# Altium project HANC_Analog.PrjPcb
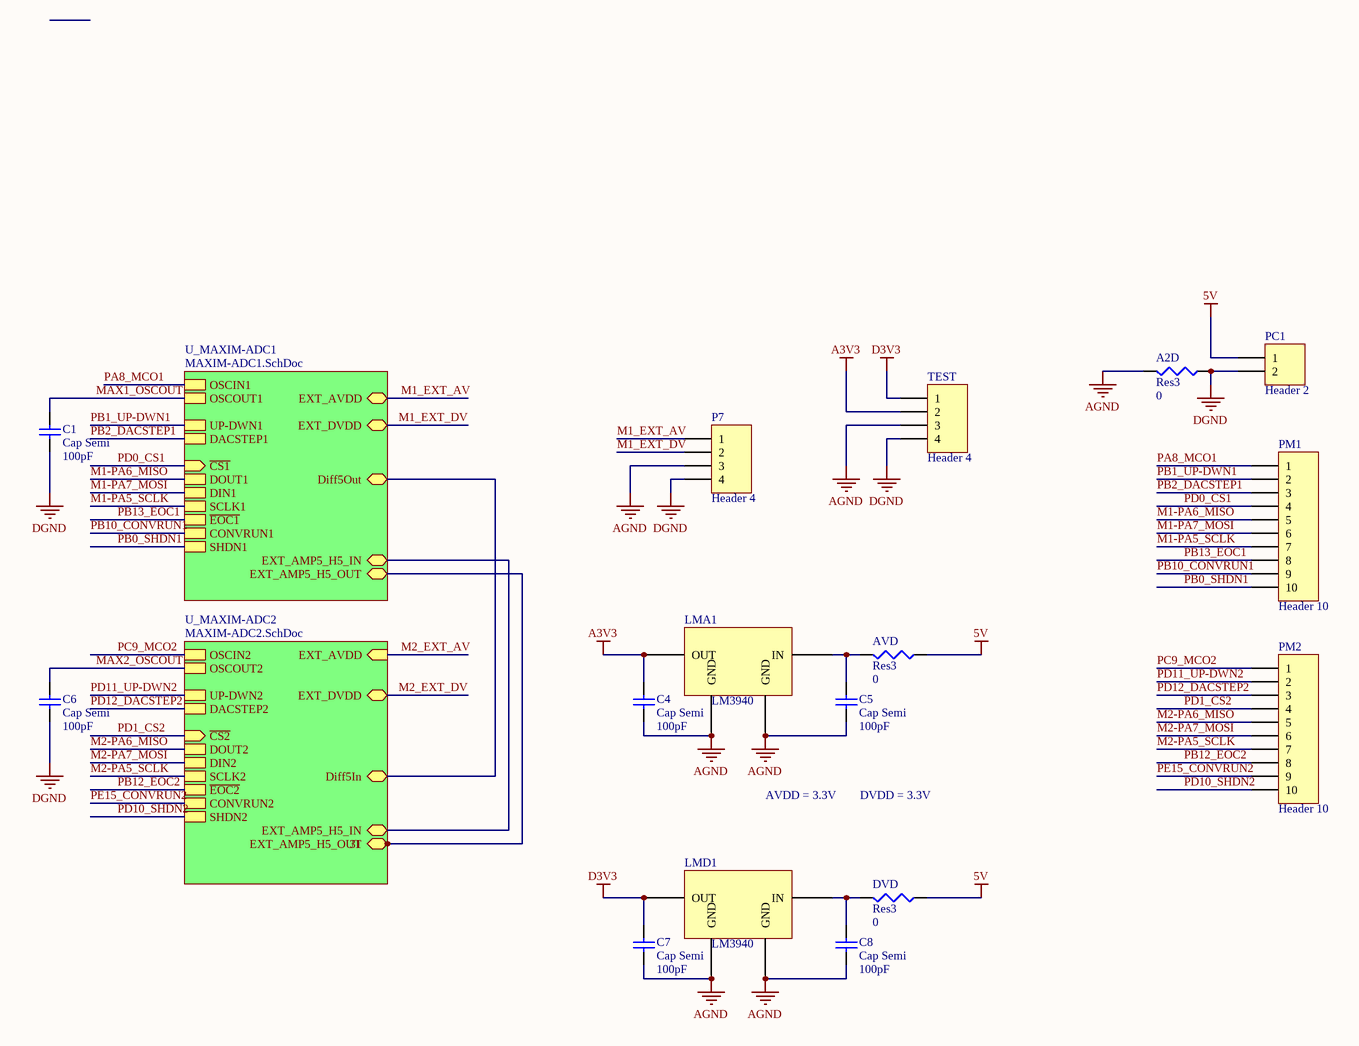
[diagram p0: HANC_Analog_TS.SchDoc]
5 sheets, 187 parts. Net scope: hierarchical (ports join the sheet entries above them; power ports are global).
Board file: HANC_ANALOG.PcbDoc
Sheets:
  HANC_Analog_TS.SchDoc
    U_MAXIM-ADC2 = MAXIM-ADC2.SchDoc
      HAMP2 = HydrophoneGroup2FilterAndAmpCircuit.SchDoc
    U_MAXIM-ADC1 = MAXIM-ADC1.SchDoc
      HAMP1 = HydrophoneGroup1FilterAndAmpCircuit.SchDoc

## Sheet HANC_Analog_TS.SchDoc
size B

### Parts
A2D  Res3  value 0  [J1-0603]
AVD  Res3  value 0  [J1-0603]
C1  Cap Semi  value 100pF  [1608[0603]]
C4  Cap Semi  value 100pF  [1608[0603]]
C5  Cap Semi  value 100pF  [1608[0603]]
C6  Cap Semi  value 100pF  [1608[0603]]
C7  Cap Semi  value 100pF  [1608[0603]]
C8  Cap Semi  value 100pF  [1608[0603]]
DVD  Res3  value 0  [J1-0603]
LMA1  LM3940  [SOT223_N]
LMD1  LM3940  [SOT223_N]
P7  Header 4  [HDR1X4]
PC1  Header 2  [HDR1X2]
PM1  Header 10  [HDR1X10]
PM2  Header 10  [HDR1X10]
TEST  Header 4  [HDR1X4]

### Sub-sheets
U_MAXIM-ADC1 = MAXIM-ADC1.SchDoc: OSCIN1, OSCOUT1, UP-DWN1, DACSTEP1, ~{CS1} (in), DOUT1, DIN1, SCLK1, ~{EOC1}, CONVRUN1, SHDN1, EXT_AVDD, EXT_DVDD, Diff5Out, EXT_AMP5_H5_IN, EXT_AMP5_H5_OUT
U_MAXIM-ADC2 = MAXIM-ADC2.SchDoc: OSCIN2, OSCOUT2, UP-DWN2, DACSTEP2, ~{CS2} (in), DOUT2, DIN2, SCLK2, ~{EOC2}, CONVRUN2, SHDN2, EXT_AVDD (in), EXT_DVDD, Diff5In, 31, EXT_AMP5_H5_OUT, EXT_AMP5_H5_IN

### Nets
5V: AVD.1 DVD.1 PC1.1
A3V3: C4.2 LMA1.3(OUT) TEST.2
AGND: A2D.2 C4.1 C5.1 C7.1 C8.1 LMA1.2(GND) LMA1.4(GND) LMD1.2(GND) LMD1.4(GND) P7.3 TEST.3
D3V3: C7.2 LMD1.3(OUT) TEST.1
DGND: A2D.1 C1.1 C6.1 P7.4 PC1.2 TEST.4
M1-PA5_SCLK: PM1.7 ; sheet U_MAXIM-ADC1/SCLK1
M1-PA6_MISO: PM1.5 ; sheet U_MAXIM-ADC1/DOUT1
M1-PA7_MOSI: PM1.6 ; sheet U_MAXIM-ADC1/DIN1
M1_EXT_AV: P7.1 ; sheet U_MAXIM-ADC1/EXT_AVDD
M1_EXT_DV: P7.2 ; sheet U_MAXIM-ADC1/EXT_DVDD
M2-PA5_SCLK: PM2.7 ; sheet U_MAXIM-ADC2/SCLK2
M2-PA6_MISO: PM2.5 ; sheet U_MAXIM-ADC2/DOUT2
M2-PA7_MOSI: PM2.6 ; sheet U_MAXIM-ADC2/DIN2
M2_EXT_AV: sheet U_MAXIM-ADC2/EXT_AVDD
M2_EXT_DV: sheet U_MAXIM-ADC2/EXT_DVDD
MAX1_OSCOUT: C1.2 ; sheet U_MAXIM-ADC1/OSCOUT1
MAX2_OSCOUT: C6.2 ; sheet U_MAXIM-ADC2/OSCOUT2
PA8_MCO1: PM1.1 ; sheet U_MAXIM-ADC1/OSCIN1
PB0_SHDN1: PM1.10 ; sheet U_MAXIM-ADC1/SHDN1
PB1_UP-DWN1: PM1.2 ; sheet U_MAXIM-ADC1/UP-DWN1
PB2_DACSTEP1: PM1.3 ; sheet U_MAXIM-ADC1/DACSTEP1
PB10_CONVRUN1: PM1.9 ; sheet U_MAXIM-ADC1/CONVRUN1
PB12_EOC2: PM2.8 ; sheet U_MAXIM-ADC2/~{EOC2}
PB13_EOC1: PM1.8 ; sheet U_MAXIM-ADC1/~{EOC1}
PC9_MCO2: PM2.1 ; sheet U_MAXIM-ADC2/OSCIN2
PD0_CS1: PM1.4 ; sheet U_MAXIM-ADC1/~{CS1}
PD1_CS2: PM2.4 ; sheet U_MAXIM-ADC2/~{CS2}
PD10_SHDN2: PM2.10 ; sheet U_MAXIM-ADC2/SHDN2
PD11_UP-DWN2: PM2.2 ; sheet U_MAXIM-ADC2/UP-DWN2
PD12_DACSTEP2: PM2.3 ; sheet U_MAXIM-ADC2/DACSTEP2
PE15_CONVRUN2: PM2.9 ; sheet U_MAXIM-ADC2/CONVRUN2
NetAVD_2: AVD.2 C5.2 LMA1.1(IN)
NetC8_2: C8.2 DVD.2 LMD1.1(IN)
NetC203_1: sheet U_MAXIM-ADC2/Diff5In, sheet U_MAXIM-ADC1/Diff5Out
NetEFIN_5: sheet U_MAXIM-ADC2/31, sheet U_MAXIM-ADC2/EXT_AMP5_H5_OUT, sheet U_MAXIM-ADC1/EXT_AMP5_H5_OUT
NetHP5O_2: sheet U_MAXIM-ADC2/EXT_AMP5_H5_IN, sheet U_MAXIM-ADC1/EXT_AMP5_H5_IN

### Notes on the sheet
- AVDD = 3.3V
- DVDD = 3.3V

### Library data of the parts
A2D AVD DVD = Res3: Resistor; Published: 8-Jun-2000; LatestRevisionDate: 29-May-2009; LatestRevisionNote: IPC-7351 Footprint Added.; PackageReference: J1-0603; Publisher: Altium Limited; PackageDescription: Chip Resistor
C1 C4-C8 = Cap Semi: Capacitor (Semiconductor SIM Model); Published: 8-Jun-2000; LatestRevisionDate: 29-May-2009; LatestRevisionNote: IPC-7351 Footprint Added.; PackageReference: C1206; Publisher: Altium Limited; PackageDescription: Chip Capacitor
LMA1 LMD1 = Component_1
P7 = Header 4: External power for ADC1; LatestRevisionDate: 17-Jul-2002; LatestRevisionNote: Re-released for DXP Platform.; Publisher: Altium Limited
PC1 = Header 2: Power for analog board; LatestRevisionDate: 17-Jul-2002; LatestRevisionNote: Re-released for DXP Platform.; Publisher: Altium Limited
PM1 = Header 10: GPIO for ADC1; LatestRevisionDate: 17-Jul-2002; LatestRevisionNote: Re-released for DXP Platform.; Publisher: Altium Limited
PM2 = Header 10: GPIO for ADC2; LatestRevisionDate: 17-Jul-2002; LatestRevisionNote: Re-released for DXP Platform.; Publisher: Altium Limited
TEST = Header 4: Header, 4-Pin; LatestRevisionDate: 17-Jul-2002; LatestRevisionNote: Re-released for DXP Platform.; Publisher: Altium Limited

## Sheet MAXIM-ADC2.SchDoc
size B
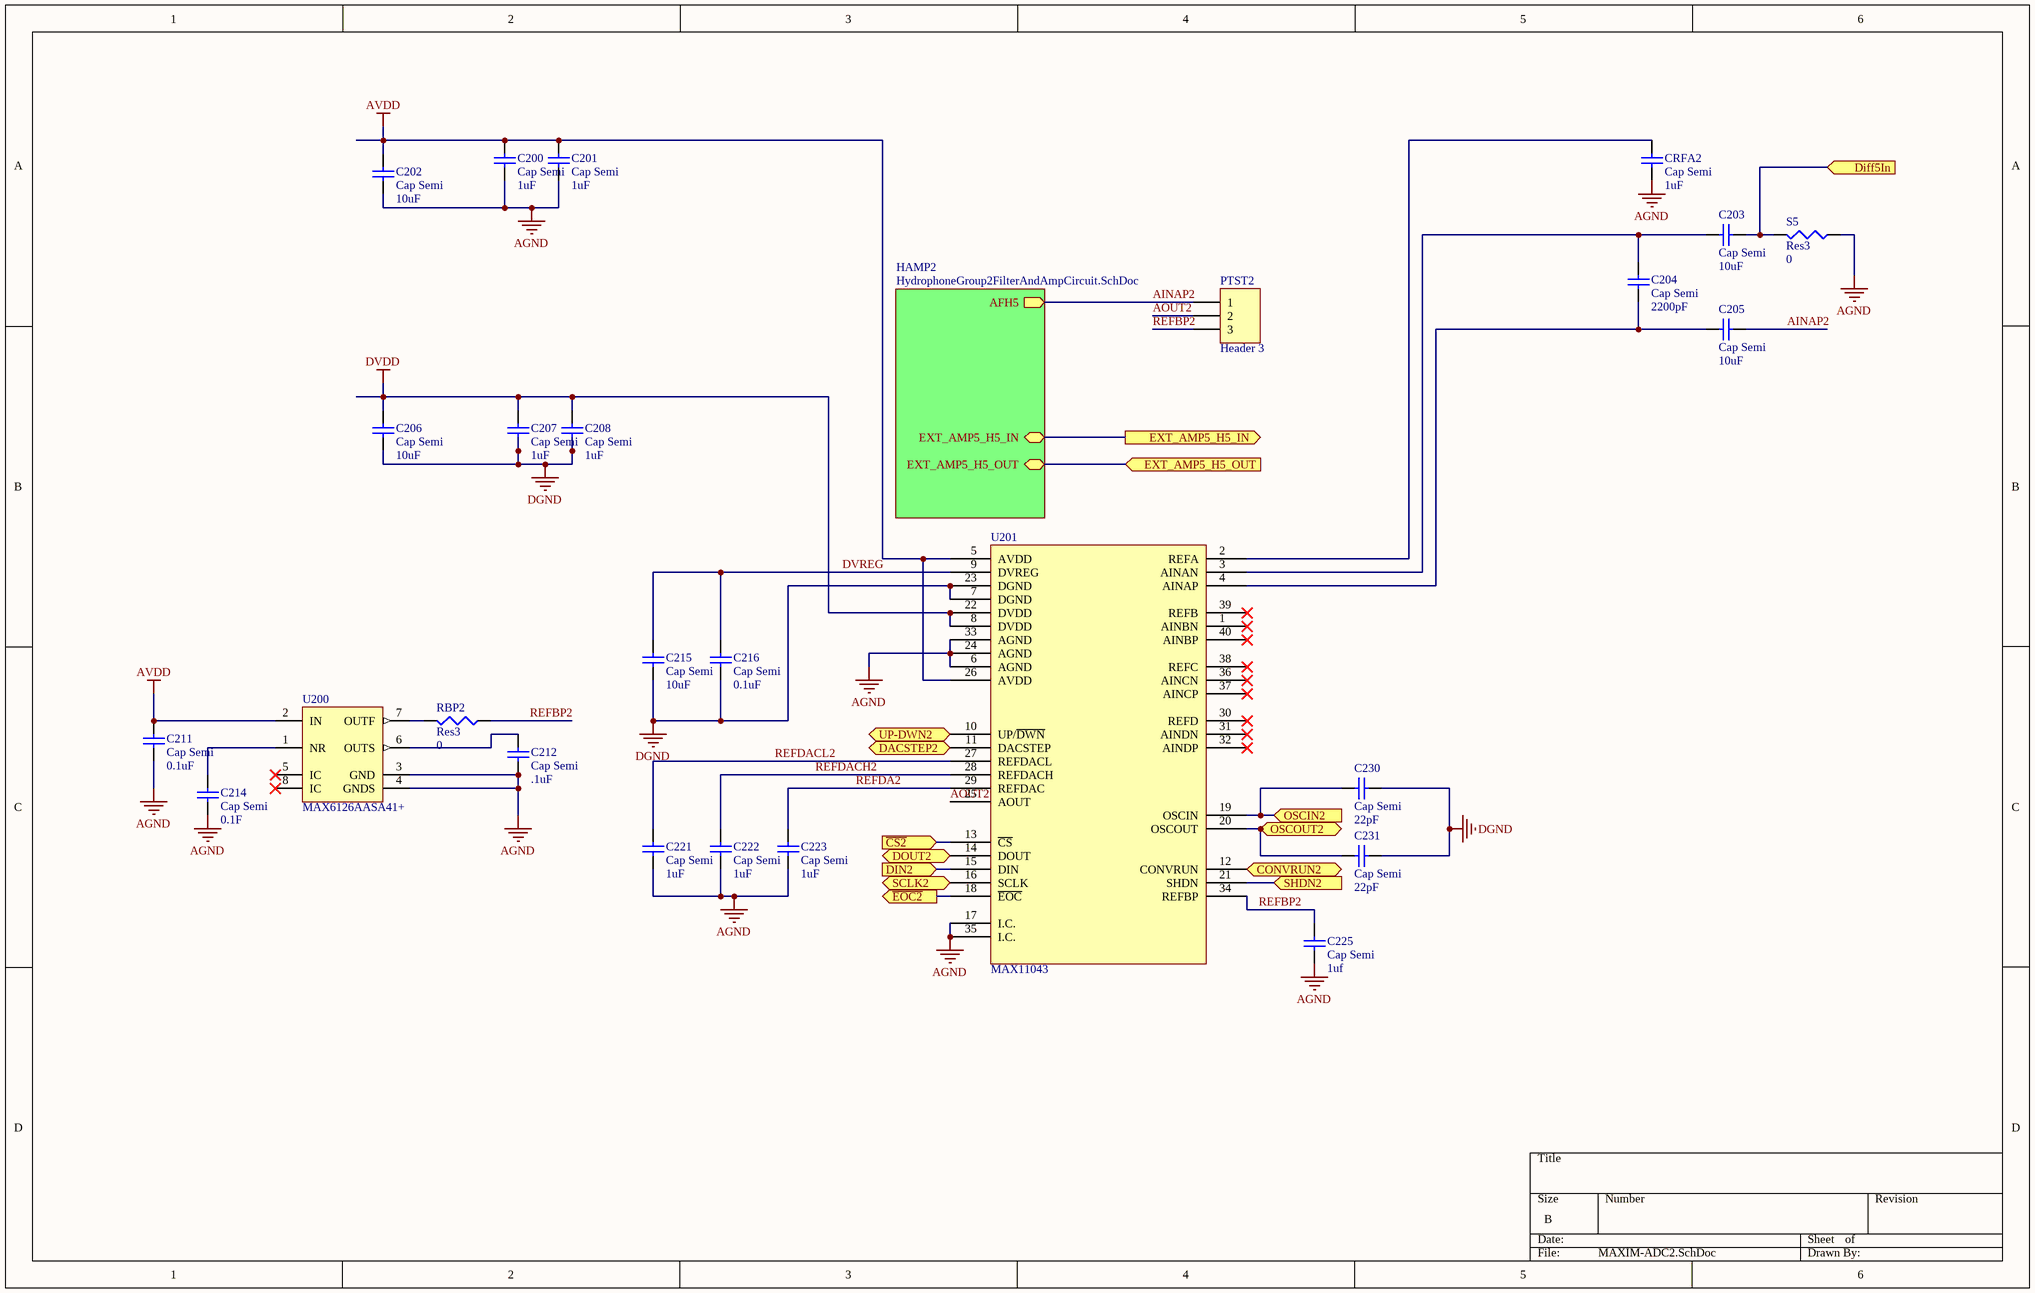
[diagram p1: MAXIM-ADC2.SchDoc]

### Parts
C200  Cap Semi  value 1uF  [1608[0603]]
C201  Cap Semi  value 1uF  [1608[0603]]
C202  Cap Semi  value 10uF  [1608[0603]]
C203  Cap Semi  value 10uF  [1608[0603]]
C204  Cap Semi  value 2200pF  [1608[0603]]
C205  Cap Semi  value 10uF  [1608[0603]]
C206  Cap Semi  value 10uF  [1608[0603]]
C207  Cap Semi  value 1uF  [1608[0603]]
C208  Cap Semi  value 1uF  [1608[0603]]
C211  Cap Semi  value 0.1uF  [1608[0603]]
C212  Cap Semi  value .1uF  [1608[0603]]
C214  Cap Semi  value 0.1F  [1608[0603]]
C215  Cap Semi  value 10uF  [1608[0603]]
C216  Cap Semi  value 0.1uF  [1608[0603]]
C221  Cap Semi  value 1uF  [1608[0603]]
C222  Cap Semi  value 1uF  [1608[0603]]
C223  Cap Semi  value 1uF  [1608[0603]]
C225  Cap Semi  value 1uf  [1608[0603]]
C230  Cap Semi  value 22pF  [1608[0603]]
C231  Cap Semi  value 22pF  [1608[0603]]
CRFA2  Cap Semi  value 1uF  [1608[0603]]
PTST2  Header 3  [HDR1X3]
RBP2  Res3  value 0  [J1-0603]
S5  Res3  value 0  [J1-0603]
U200  MAX6126AASA41+  [MAXM-S8+4_M]
U201  MAX11043  [QFN50P600X600X80_HS-41N]

### Sub-sheets
HAMP2 = HydrophoneGroup2FilterAndAmpCircuit.SchDoc: AFH5 (out), EXT_AMP5_H5_IN, EXT_AMP5_H5_OUT

### Ports
CONVRUN2 (in), DACSTEP2 (in), Diff5In (in), DIN2 (in), DOUT2, EXT_AMP5_H5_IN (out), EXT_AMP5_H5_OUT (in), OSCIN2 (in), OSCOUT2 (out), SCLK2 (in), SHDN2 (in), UP-DWN2 (in), ~{CS2} (in), ~{EOC2} (out)

### Nets
AGND: C200.2 C201.2 C202.2 C211.2 C212.2 C214.2 C221.1 C222.2 C223.1 C225.2 CRFA2.1 S5.1 U200.3(GND) U200.4(GNDS) U201.6(AGND) U201.17(I.C.) U201.24(AGND) U201.33(AGND) U201.35(I.C.)
AVDD: C200.1 C201.1 C202.1 C211.1 U200.2(IN) U201.5(AVDD) U201.26(AVDD)
DGND: C206.2 C207.2 C208.2 C215.2 C216.2 C230.2 C231.2 U201.7(DGND) U201.23(DGND)
DVDD: C206.1 C207.1 C208.1 U201.8(DVDD) U201.22(DVDD)
AINAP2: C205.1 PTST2.1 ; sheet HAMP2/AFH5
AOUT2: PTST2.2 U201.25(AOUT)
DVREG: C215.1 C216.1 U201.9(DVREG)
M2-PA5_SCLK: U201.16(SCLK) ; port SCLK2
M2-PA6_MISO: U201.14(DOUT) ; port DOUT2
M2-PA7_MOSI: U201.15(DIN) ; port DIN2
MAX2_OSCOUT: C231.1 U201.20(OSCOUT) ; port OSCOUT2
PB12_EOC2: U201.18(~{EOC}) ; port ~{EOC2}
PC9_MCO2: C230.1 U201.19(OSCIN) ; port OSCIN2
PD1_CS2: U201.13(~{CS}) ; port ~{CS2}
PD10_SHDN2: U201.21(SHDN) ; port SHDN2
PD11_UP-DWN2: U201.10(UP/~{DWN}) ; port UP-DWN2
PD12_DACSTEP2: U201.11(DACSTEP) ; port DACSTEP2
PE15_CONVRUN2: U201.12(CONVRUN) ; port CONVRUN2
REFBP2: C225.1 PTST2.3 RBP2.1 U201.34(REFBP)
REFDA2: C223.2 U201.29(REFDAC)
REFDACH2: C222.1 U201.28(REFDACH)
REFDACL2: C221.2 U201.27(REFDACL)
NetC203_1: C203.1 S5.2 ; port Diff5In
NetC203_2: C203.2 C204.2 U201.3(AINAN)
NetC204_1: C204.1 C205.2 U201.4(AINAP)
NetC212_1: C212.1 U200.6(OUTS)
NetC214_1: C214.1 U200.1(NR)
NetCRFA2_2: CRFA2.2 U201.2(REFA)
NetEFIN_5: port EXT_AMP5_H5_OUT, sheet HAMP2/EXT_AMP5_H5_OUT
NetHP5O_2: port EXT_AMP5_H5_IN, sheet HAMP2/EXT_AMP5_H5_IN
NetRBP2_2: RBP2.2 U200.7(OUTF)

Not connected (* = marked no-connect by the designer): U200 5(IC)* 8(IC)*; U201 1(AINBN)* 30(REFD)* 31(AINDN)* 32(AINDP)* 36(AINCN)* 37(AINCP)* 38(REFC)* 39(REFB)* 40(AINBP)*

### Library data of the parts
C200-C208 C211 C212 C214-C216 C221-C223 C225 C230 C231 CRFA2 = Cap Semi: Capacitor (Semiconductor SIM Model); Published: 8-Jun-2000; LatestRevisionDate: 29-May-2009; LatestRevisionNote: IPC-7351 Footprint Added.; PackageReference: C1206; Publisher: Altium Limited; PackageDescription: Chip Capacitor
PTST2 = Header 3: ADC2 Signal Test Header; LatestRevisionDate: 17-Jul-2002; LatestRevisionNote: Re-released for DXP Platform.; Publisher: Altium Limited
RBP2 S5 = Res3: Resistor; Published: 8-Jun-2000; LatestRevisionDate: 29-May-2009; LatestRevisionNote: IPC-7351 Footprint Added.; PackageReference: J1-0603; Publisher: Altium Limited; PackageDescription: Chip Resistor
U200 = CMP-0977-00016-1: Ultra-High-Precision, Ultra-Low-Noise, Series Voltage Reference, 4.096 V, -40 to 125 degC, 8-Pin SOIC (S8+4), RoHS, Tube; Manufacturer: Maxim; Output Voltage Accuracy: 0.02% Max.; Line Regulation: 60 uV/V Max.; VOUT: 4.096 V; Dropout Voltage@10 mA: 0.1 V Typ.; VIN: 4.3 to 12.6 V; Operating Temperature: -40 to 125 degC; ComponentLink3URL: http://pdfserv.maximintegrated.com/package_dwgs/21-0041.PDF; PartNumber: MAX6126AASA41+; RoHS: TRUE; ComponentLink3Description: Package Specification; ComponentLink1URL: http://www.maximintegrated.com/; Mounting Technology: Surface Mount; Packing: Tube; DatasheetVersion: Rev. 6; ComponentLink1Description: Manufacturer URL; ComponentLink2URL: http://datasheets.maximintegrated.com/en/ds/MAX6126.pdf; PackageDescription: 8-Pin Small Outline Integrated Circuit Package, Body 4.9 x 3.9 mm, Pitch 1.27 mm; ComponentLink2Description: Datasheet; PackageVersion: Rev. E

## Sheet HydrophoneGroup2FilterAndAmpCircuit.SchDoc
size C
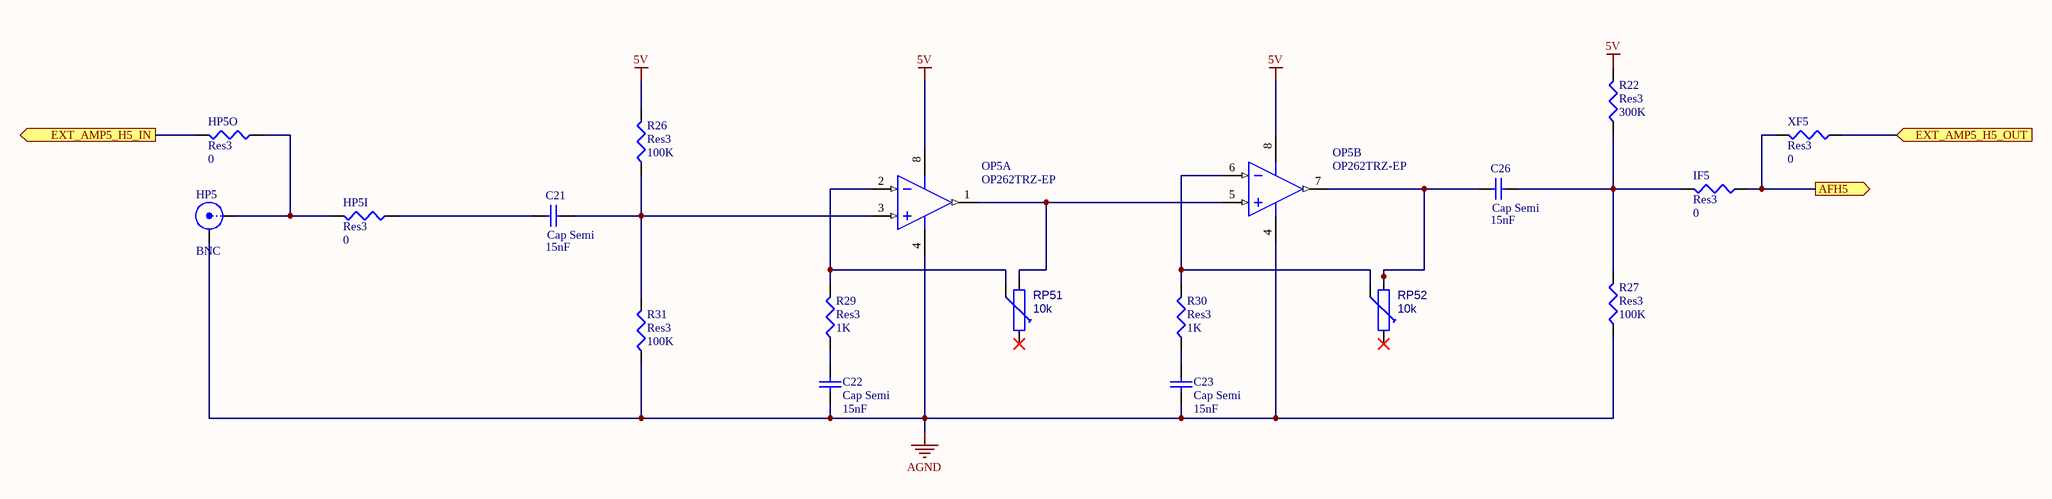
[diagram p2: HydrophoneGroup2FilterAndAmpCircuit.SchDoc]

### Parts
C21  Cap Semi  value 15nF  [C0805]
C22  Cap Semi  value 15nF  [C0805]
C23  Cap Semi  value 15nF  [C0805]
C26  Cap Semi  value 15nF  [C0805]
HP5  BNC  [BNC_RA CON]
HP5I  Res3  value 0  [J1-0603]
HP5O  Res3  value 0  [J1-0603]
IF5  Res3  value 0  [J1-0603]
OP5  OP262TRZ-EP  [ADI-R-8_N]  (parts A,B of 2)
R22  Res3  value 300K  [J1-0603]
R26  Res3  value 100K  [J1-0603]
R27  Res3  value 100K  [J1-0603]
R29  Res3  value 1K  [J1-0603]
R30  Res3  value 1K  [J1-0603]
R31  Res3  value 100K  [J1-0603]
RP51  10k  [Trim_Bourns3296]
RP52  10k  [Trim_Bourns3296]
XF5  Res3  value 0  [J1-0603]

### Ports
AFH5 (out), EXT_AMP5_H5_IN (out), EXT_AMP5_H5_OUT (in)

### Nets
5V: OP5.8(+V) R22.2 R26.2
AGND: C22.1 C23.1 HP5.2(Y) OP5.4(-V) R27.1 R31.1
AINAP2: IF5.1 XF5.2 ; port AFH5
NetC21_1: C21.1 HP5I.1
NetC21_2: C21.2 OP5.3(+IN_A) R26.1 R31.2
NetC22_2: C22.2 R29.1
NetC23_2: C23.2 R30.1
NetC26_1: C26.1 OP5.7(OUT_B) RP52.1
NetC26_2: C26.2 IF5.2 R22.1 R27.2
NetEFIN_5: XF5.1 ; port EXT_AMP5_H5_OUT
NetHP5_1: HP5.1(X) HP5I.2 HP5O.1
NetHP5O_2: HP5O.2 ; port EXT_AMP5_H5_IN
NetOP5_1: OP5.1(OUT_A) OP5.5(+IN_B) RP51.1
NetOP5_2: OP5.2(-IN_A) R29.2 RP51.2
NetOP5_6: OP5.6(-IN_B) R30.2 RP52.2

Not connected (* = marked no-connect by the designer): RP51 3*; RP52 3*

### Library data of the parts
C21-C23 C26 = Cap Semi: Capacitor (Semiconductor SIM Model); Published: 8-Jun-2000; LatestRevisionDate: 29-May-2009; LatestRevisionNote: IPC-7351 Footprint Added.; PackageReference: C1206; Publisher: Altium Limited; PackageDescription: Chip Capacitor
HP5 = BNC: BNC Elbow Connector; LatestRevisionDate: 17-Jul-2002; LatestRevisionNote: Re-released for DXP Platform.; Publisher: Altium Limited
HP5I HP5O IF5 R22 R26 R27 R29-R31 XF5 = Res3: Resistor; Published: 8-Jun-2000; LatestRevisionDate: 29-May-2009; LatestRevisionNote: IPC-7351 Footprint Added.; PackageReference: J1-0603; Publisher: Altium Limited; PackageDescription: Chip Resistor
OP5 = OP262TRZ-EP: Double Channel Wide Bandwidth Operational Amplifier, 15 MHz BW, 13 V/us SR, Military, 8-pin SOIC (R-8), Tube; Generic Part Number: OP262; Manufacturer: Analog Devices; Amplifiers Per Package: 2; Input Bias Current: 260nA; Input Offset Voltage: 25uV; Iq/Amp: 775uA; Slew Rate: 13V/us; Small Signal Bandwidth: 15MHz; V Span Max: 12V; V Span Min: 2.7V; DatasheetVersion: Rev. G; PackageVersion: 060506-A; PackageReference: R-8; PackageDescription: 8-Pin Standard Small Outline Package, Body 3.9 x 4.9 mm, Pitch 1.27 mm; Supplier 1: Digi-Key; Supplier Part Number 1: OP262TRZ-EP-ND; Supplier 2: Newark; Supplier Part Number 2: 85R9009; Packing: Tube; Mounting Technology: Surface Mount; Code_JEDEC: MS-012-AA; PartNumber: OP262TRZ-EP; ComponentLink1Description: Manufacturer URL; ComponentLink1URL: http://www.analog.com/en/index.html; ComponentLink2Description: Datasheet; ComponentLink2URL: http://www.analog.com/static/imported-files/data_sheets/OP162_262_462.pdf; ComponentLink3Description: Package Specification; ComponentLink3URL: http://www.analog.com/static/imported-files/packages/PKG_PDF/SOIC_Narrow%20(R)/R_8.pdf
RP51 RP52 = RES_Trim: Resistor Trimmer; Part_Number: RES_Trim_Bourns3296; Part Description: Trimmer, Bourns 3296 0.5W; Mfr Part Number: Bourns 3296Y-1-xxxLF; Validated: False; Value: 10k; Type: RES; Distributor info: RS 3296Y-1-xxxLF (1k=3296Y-1-102LF); Price: 2,03; ComponentLink1Description: Manufacturer; ComponentLink1URL: http://bourns.de/; Creation Date: 05.12.2011; IPC: False

## Sheet MAXIM-ADC1.SchDoc
size B
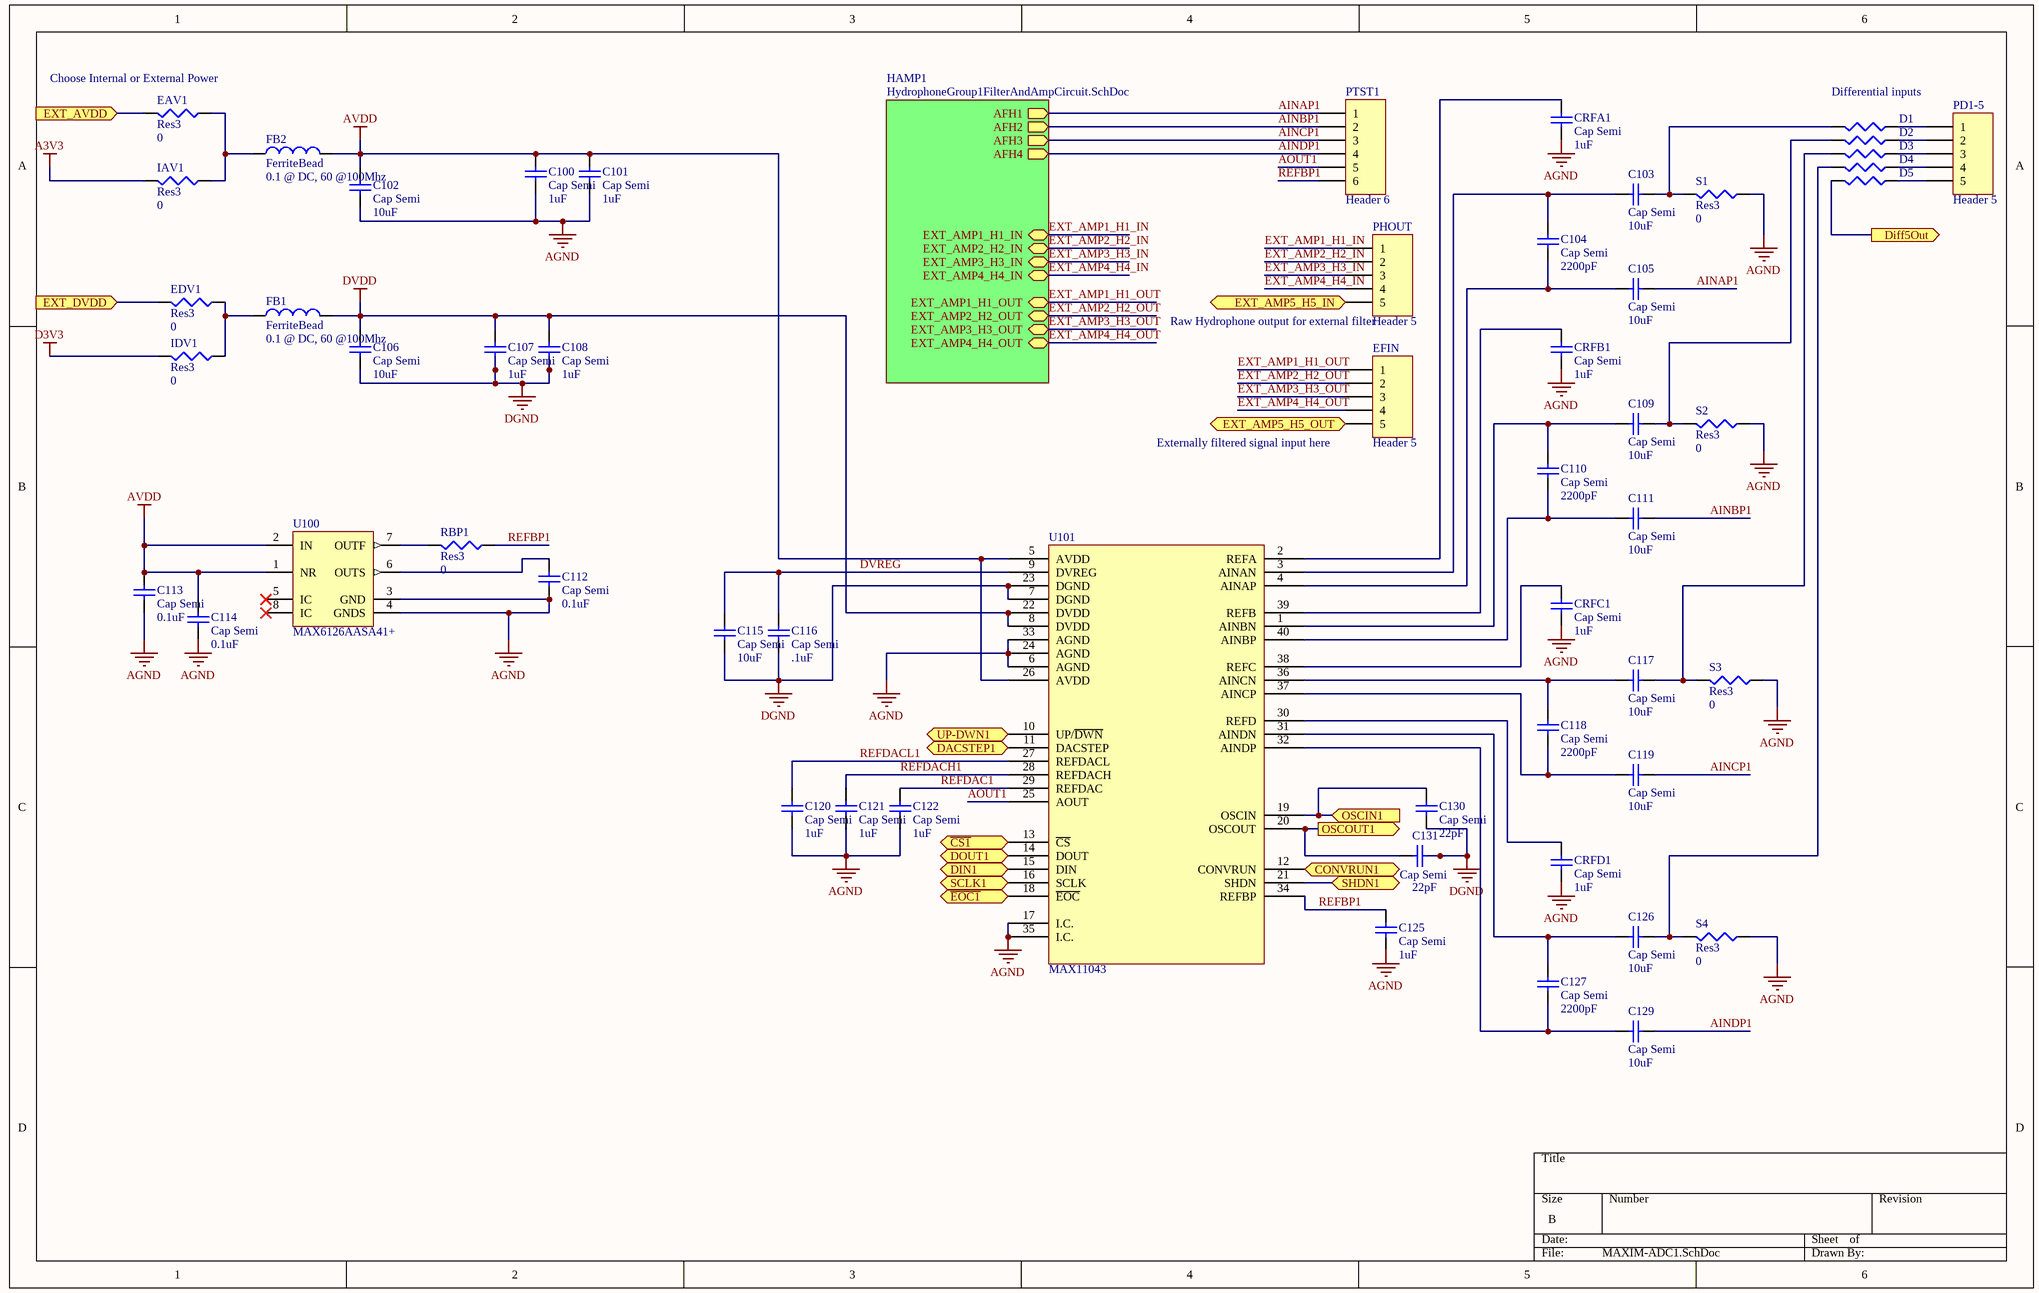
[diagram p3: MAXIM-ADC1.SchDoc]

### Parts
C100  Cap Semi  value 1uF  [1608[0603]]
C101  Cap Semi  value 1uF  [1608[0603]]
C102  Cap Semi  value 10uF  [1608[0603]]
C103  Cap Semi  value 10uF  [1608[0603]]
C104  Cap Semi  value 2200pF  [1608[0603]]
C105  Cap Semi  value 10uF  [1608[0603]]
C106  Cap Semi  value 10uF  [1608[0603]]
C107  Cap Semi  value 1uF  [1608[0603]]
C108  Cap Semi  value 1uF  [1608[0603]]
C109  Cap Semi  value 10uF  [1608[0603]]
C110  Cap Semi  value 2200pF  [1608[0603]]
C111  Cap Semi  value 10uF  [1608[0603]]
C112  Cap Semi  value 0.1uF  [1608[0603]]
C113  Cap Semi  value 0.1uF  [1608[0603]]
C114  Cap Semi  value 0.1uF  [1608[0603]]
C115  Cap Semi  value 10uF  [1608[0603]]
C116  Cap Semi  value .1uF  [1608[0603]]
C117  Cap Semi  value 10uF  [1608[0603]]
C118  Cap Semi  value 2200pF  [1608[0603]]
C119  Cap Semi  value 10uF  [1608[0603]]
C120  Cap Semi  value 1uF  [1608[0603]]
C121  Cap Semi  value 1uF  [1608[0603]]
C122  Cap Semi  value 1uF  [1608[0603]]
C125  Cap Semi  value 1uF  [1608[0603]]
C126  Cap Semi  value 10uF  [1608[0603]]
C127  Cap Semi  value 2200pF  [1608[0603]]
C129  Cap Semi  value 10uF  [1608[0603]]
C130  Cap Semi  value 22pF  [1608[0603]]
C131  Cap Semi  value 22pF  [1608[0603]]
CRFA1  Cap Semi  value 1uF  [1608[0603]]
CRFB1  Cap Semi  value 1uF  [1608[0603]]
CRFC1  Cap Semi  value 1uF  [1608[0603]]
CRFD1  Cap Semi  value 1uF  [1608[0603]]
D1  Res3  [J1-0603]  (value not drawn)
D2  Res3  [J1-0603]  (value not drawn)
D3  Res3  [J1-0603]  (value not drawn)
D4  Res3  [J1-0603]  (value not drawn)
D5  Res3  [J1-0603]  (value not drawn)
EAV1  Res3  value 0  [J1-0603]
EDV1  Res3  value 0  [J1-0603]
EFIN  Header 5  [HDR1X5]
FB1  FerriteBead  value 0.1 @ DC, 60 @100Mhz  [0603]
FB2  FerriteBead  value 0.1 @ DC, 60 @100Mhz  [0603]
IAV1  Res3  value 0  [J1-0603]
IDV1  Res3  value 0  [J1-0603]
PD1-5  Header 5  [HDR1X5]
PHOUT  Header 5  [HDR1X5]
PTST1  Header 6  [HDR1X6]
RBP1  Res3  value 0  [J1-0603]
S1  Res3  value 0  [J1-0603]
S2  Res3  value 0  [J1-0603]
S3  Res3  value 0  [J1-0603]
S4  Res3  value 0  [J1-0603]
U100  MAX6126AASA41+  [MAXM-S8+4_L]
U101  MAX11043  [QFN50P600X600X80_HS-41N]

### Sub-sheets
HAMP1 = HydrophoneGroup1FilterAndAmpCircuit.SchDoc: AFH1 (out), AFH2 (out), AFH3 (out), AFH4 (out), EXT_AMP1_H1_IN, EXT_AMP2_H2_IN, EXT_AMP3_H3_IN, EXT_AMP4_H4_IN, EXT_AMP1_H1_OUT, EXT_AMP2_H2_OUT, EXT_AMP3_H3_OUT, EXT_AMP4_H4_OUT

### Ports
CONVRUN1 (in), DACSTEP1 (in), Diff5Out (out), DIN1 (in), DOUT1 (out), EXT_AMP5_H5_IN (in), EXT_AMP5_H5_OUT (out), EXT_AVDD (in), EXT_DVDD (in), OSCIN1 (in), OSCOUT1 (out), SCLK1 (in), SHDN1, UP-DWN1 (in), ~{CS1} (in), ~{EOC1} (out)

### Nets
A3V3: IAV1.2
AGND: C100.2 C101.2 C102.2 C112.2 C113.2 C114.2 C120.1 C121.2 C122.1 C125.2 CRFA1.1 CRFB1.1 CRFC1.1 CRFD1.1 S1.1 S2.1 S3.1 S4.1 U100.3(GND) U100.4(GNDS) U101.6(AGND) U101.17(I.C.) U101.24(AGND) U101.33(AGND) U101.35(I.C.)
AVDD: C100.1 C101.1 C102.1 C113.1 C114.1 FB2.2 U100.1(NR) U100.2(IN) U101.5(AVDD) U101.26(AVDD)
D3V3: IDV1.2
DGND: C106.2 C107.2 C108.2 C115.2 C116.2 C130.2 C131.2 U101.7(DGND) U101.23(DGND)
DVDD: C106.1 C107.1 C108.1 FB1.2 U101.8(DVDD) U101.22(DVDD)
AINAP1: C105.1 PTST1.1 ; sheet HAMP1/AFH1
AINBP1: C111.1 PTST1.2 ; sheet HAMP1/AFH2
AINCP1: C119.1 PTST1.3 ; sheet HAMP1/AFH3
AINDP1: C129.1 PTST1.4 ; sheet HAMP1/AFH4
AOUT1: PTST1.5 U101.25(AOUT)
DVREG: C115.1 C116.1 U101.9(DVREG)
EXT_AMP1_H1_IN: PHOUT.1 ; sheet HAMP1/EXT_AMP1_H1_IN
EXT_AMP1_H1_OUT: EFIN.1 ; sheet HAMP1/EXT_AMP1_H1_OUT
EXT_AMP2_H2_IN: PHOUT.2 ; sheet HAMP1/EXT_AMP2_H2_IN
EXT_AMP2_H2_OUT: EFIN.2 ; sheet HAMP1/EXT_AMP2_H2_OUT
EXT_AMP3_H3_IN: PHOUT.3 ; sheet HAMP1/EXT_AMP3_H3_IN
EXT_AMP3_H3_OUT: EFIN.3 ; sheet HAMP1/EXT_AMP3_H3_OUT
EXT_AMP4_H4_IN: PHOUT.4 ; sheet HAMP1/EXT_AMP4_H4_IN
EXT_AMP4_H4_OUT: EFIN.4 ; sheet HAMP1/EXT_AMP4_H4_OUT
M1-PA5_SCLK: U101.16(SCLK) ; port SCLK1
M1-PA6_MISO: U101.14(DOUT) ; port DOUT1
M1-PA7_MOSI: U101.15(DIN) ; port DIN1
M1_EXT_AV: EAV1.2 ; port EXT_AVDD
M1_EXT_DV: EDV1.2 ; port EXT_DVDD
MAX1_OSCOUT: C131.1 U101.20(OSCOUT) ; port OSCOUT1
PA8_MCO1: C130.1 U101.19(OSCIN) ; port OSCIN1
PB0_SHDN1: U101.21(SHDN) ; port SHDN1
PB1_UP-DWN1: U101.10(UP/~{DWN}) ; port UP-DWN1
PB2_DACSTEP1: U101.11(DACSTEP) ; port DACSTEP1
PB10_CONVRUN1: U101.12(CONVRUN) ; port CONVRUN1
PB13_EOC1: U101.18(~{EOC}) ; port ~{EOC1}
PD0_CS1: U101.13(~{CS}) ; port ~{CS1}
REFBP1: C125.1 PTST1.6 RBP1.1 U101.34(REFBP)
REFDAC1: C122.2 U101.29(REFDAC)
REFDACH1: C121.1 U101.28(REFDACH)
REFDACL1: C120.2 U101.27(REFDACL)
NetC103_1: C103.1 D1.2 S1.2
NetC103_2: C103.2 C104.2 U101.3(AINAN)
NetC104_1: C104.1 C105.2 U101.4(AINAP)
NetC109_1: C109.1 D2.2 S2.2
NetC109_2: C109.2 C110.2 U101.1(AINBN)
NetC110_1: C110.1 C111.2 U101.40(AINBP)
NetC112_1: C112.1 U100.6(OUTS)
NetC117_1: C117.1 D3.2 S3.2
NetC117_2: C117.2 C118.2 U101.36(AINCN)
NetC118_1: C118.1 C119.2 U101.37(AINCP)
NetC126_1: C126.1 D4.2 S4.2
NetC126_2: C126.2 C127.2 U101.31(AINDN)
NetC127_1: C127.1 C129.2 U101.32(AINDP)
NetC203_1: D5.2 ; port Diff5Out
NetCRFA1_2: CRFA1.2 U101.2(REFA)
NetCRFB1_2: CRFB1.2 U101.39(REFB)
NetCRFC1_2: CRFC1.2 U101.38(REFC)
NetCRFD1_2: CRFD1.2 U101.30(REFD)
NetD1_1: D1.1 PD1-5.1
NetD2_1: D2.1 PD1-5.2
NetD3_1: D3.1 PD1-5.3
NetD4_1: D4.1 PD1-5.4
NetD5_1: D5.1 PD1-5.5
NetEAV1_1: EAV1.1 FB2.1 IAV1.1
NetEDV1_1: EDV1.1 FB1.1 IDV1.1
NetEFIN_5: EFIN.5 ; port EXT_AMP5_H5_OUT
NetHP5O_2: PHOUT.5 ; port EXT_AMP5_H5_IN
NetRBP1_2: RBP1.2 U100.7(OUTF)

Not connected (* = marked no-connect by the designer): U100 5(IC)* 8(IC)*

### Notes on the sheet
- (near EAV1) Choose Internal or External Power
- Differential inputs
- (near PHOUT) Raw Hydrophone output for external filter
- (near EFIN) Externally filtered signal input here

### Library data of the parts
C100-C122 C125-C127 C129-C131 CRFA1 CRFB1 CRFC1 CRFD1 = Cap Semi: Capacitor (Semiconductor SIM Model); Published: 8-Jun-2000; LatestRevisionDate: 29-May-2009; LatestRevisionNote: IPC-7351 Footprint Added.; PackageReference: C1206; Publisher: Altium Limited; PackageDescription: Chip Capacitor
D1-D5 = Res3: Resistor; Value: 0; Published: 8-Jun-2000; LatestRevisionDate: 29-May-2009; LatestRevisionNote: IPC-7351 Footprint Added.; PackageReference: J1-0603; Publisher: Altium Limited; PackageDescription: Chip Resistor
EAV1 EDV1 IAV1 IDV1 RBP1 S1-S4 = Res3: Resistor; Published: 8-Jun-2000; LatestRevisionDate: 29-May-2009; LatestRevisionNote: IPC-7351 Footprint Added.; PackageReference: J1-0603; Publisher: Altium Limited; PackageDescription: Chip Resistor
EFIN PD1-5 PHOUT = Header 5: Header, 5-Pin; LatestRevisionDate: 17-Jul-2002; LatestRevisionNote: Re-released for DXP Platform.; Publisher: Altium Limited
FB1 FB2 = Inductor: Code_IEC: 1005; Published: 8-Jun-2000; LatestRevisionDate: 29-May-2009; LatestRevisionNote: IPC-7351 Footprint Added.; PackageReference: 0402-A; Publisher: Altium Limited; PackageDescription: Chip Inductor; Code_JEITA: 0402
PTST1 = Header 6: ADC1 signal test; LatestRevisionDate: 17-Jul-2002; LatestRevisionNote: Re-released for DXP Platform.; Publisher: Altium Limited
U100 = CMP-0977-00016-1: as U200 on sheet MAXIM-ADC2; Operating Temperature: -40 to 125 degC; ComponentLink3URL: http://pdfserv.maximintegrated.com/package_dwgs/21-0041.PDF; PartNumber: MAX6126AASA41+; RoHS: TRUE; ComponentLink3Description: Package Specification; ComponentLink1URL: http://www.maximintegrated.com/; Mounting Technology: Surface Mount; Packing: Tube; DatasheetVersion: Rev. 6; ComponentLink1Description: Manufacturer URL; ComponentLink2URL: http://datasheets.maximintegrated.com/en/ds/MAX6126.pdf; PackageDescription: 8-Pin Small Outline Integrated Circuit Package, Body 4.9 x 3.9 mm, Pitch 1.27 mm; ComponentLink2Description: Datasheet; PackageVersion: Rev. E

## Sheet HydrophoneGroup1FilterAndAmpCircuit.SchDoc
size C
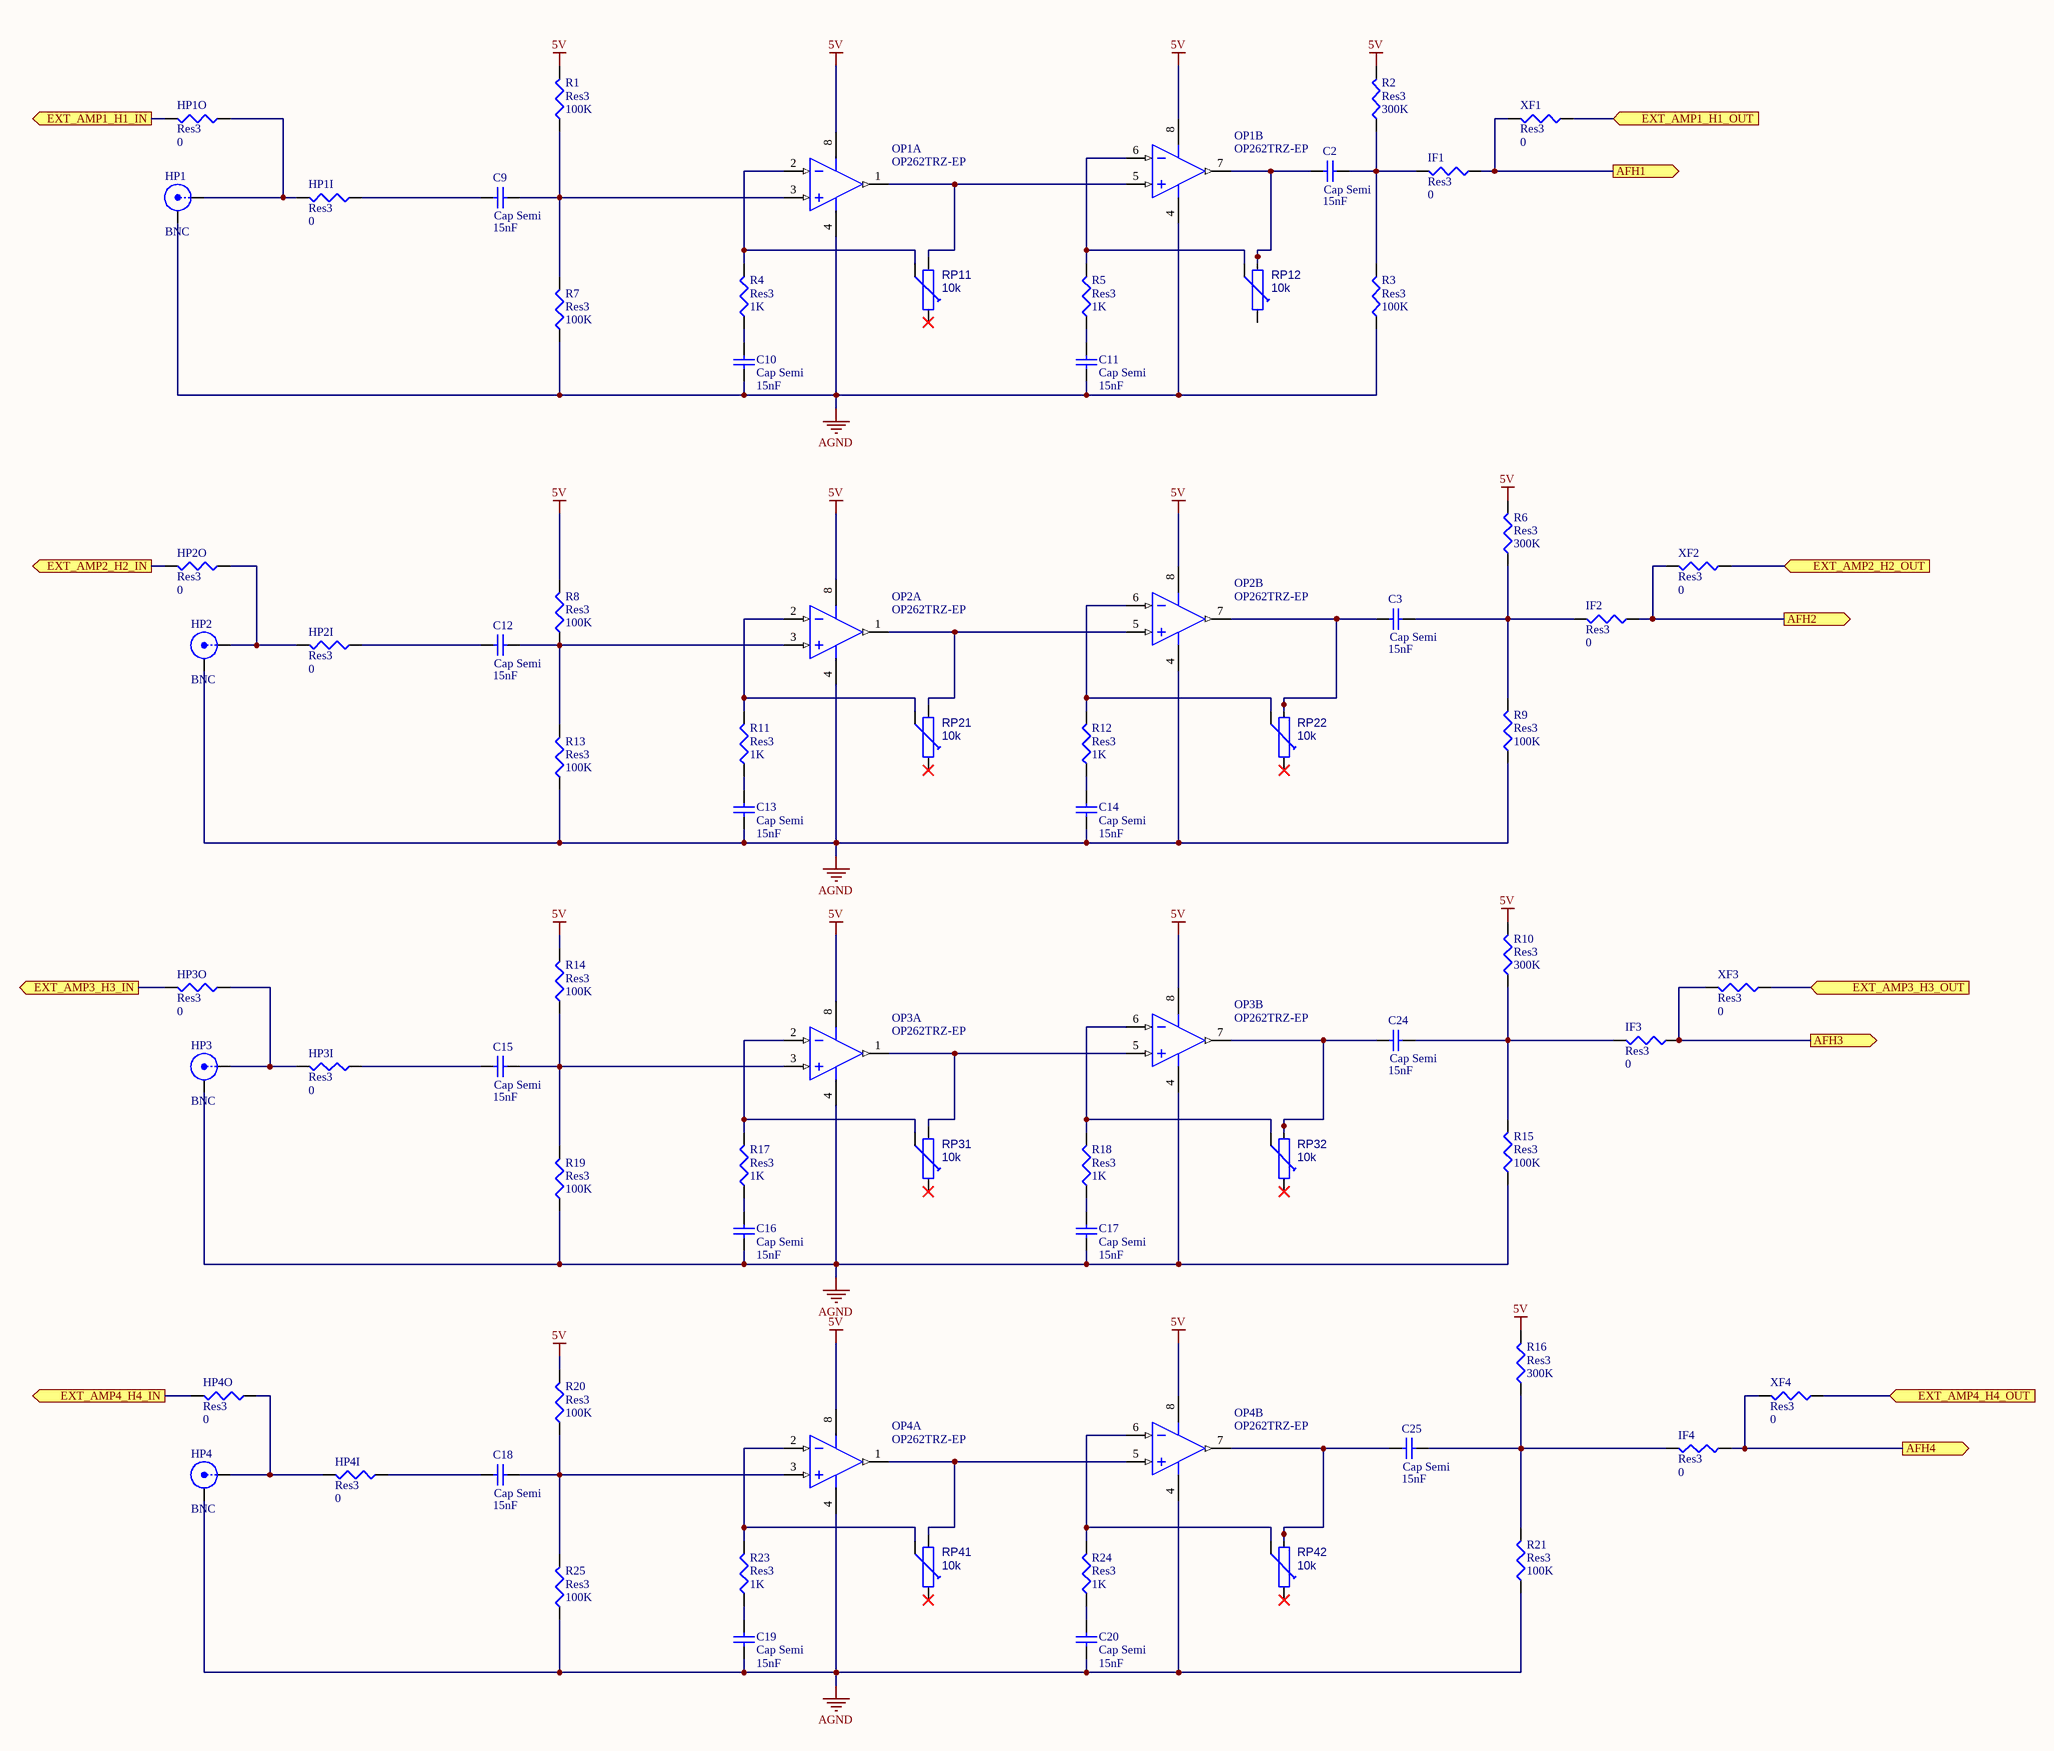
[diagram p4: HydrophoneGroup1FilterAndAmpCircuit.SchDoc]

### Parts
C2  Cap Semi  value 15nF  [C0805]
C3  Cap Semi  value 15nF  [C0805]
C9  Cap Semi  value 15nF  [C0805]
C10  Cap Semi  value 15nF  [C0805]
C11  Cap Semi  value 15nF  [C0805]
C12  Cap Semi  value 15nF  [C0805]
C13  Cap Semi  value 15nF  [C0805]
C14  Cap Semi  value 15nF  [C0805]
C15  Cap Semi  value 15nF  [C0805]
C16  Cap Semi  value 15nF  [C0805]
C17  Cap Semi  value 15nF  [C0805]
C18  Cap Semi  value 15nF  [C0805]
C19  Cap Semi  value 15nF  [C0805]
C20  Cap Semi  value 15nF  [C0805]
C24  Cap Semi  value 15nF  [C0805]
C25  Cap Semi  value 15nF  [C0805]
HP1  BNC  [BNC_RA CON]
HP1I  Res3  value 0  [J1-0603]
HP1O  Res3  value 0  [J1-0603]
HP2  BNC  [BNC_RA CON]
HP2I  Res3  value 0  [J1-0603]
HP2O  Res3  value 0  [J1-0603]
HP3  BNC  [BNC_RA CON]
HP3I  Res3  value 0  [J1-0603]
HP3O  Res3  value 0  [J1-0603]
HP4  BNC  [BNC_RA CON]
HP4I  Res3  value 0  [J1-0603]
HP4O  Res3  value 0  [J1-0603]
IF1  Res3  value 0  [J1-0603]
IF2  Res3  value 0  [J1-0603]
IF3  Res3  value 0  [J1-0603]
IF4  Res3  value 0  [J1-0603]
OP1  OP262TRZ-EP  [ADI-R-8_N]  (parts A,B of 2)
OP2  OP262TRZ-EP  [ADI-R-8_N]  (parts A,B of 2)
OP3  OP262TRZ-EP  [ADI-R-8_N]  (parts A,B of 2)
OP4  OP262TRZ-EP  [ADI-R-8_N]  (parts A,B of 2)
R1  Res3  value 100K  [J1-0603]
R2  Res3  value 300K  [J1-0603]
R3  Res3  value 100K  [J1-0603]
R4  Res3  value 1K  [J1-0603]
R5  Res3  value 1K  [J1-0603]
R6  Res3  value 300K  [J1-0603]
R7  Res3  value 100K  [J1-0603]
R8  Res3  value 100K  [J1-0603]
R9  Res3  value 100K  [J1-0603]
R10  Res3  value 300K  [J1-0603]
R11  Res3  value 1K  [J1-0603]
R12  Res3  value 1K  [J1-0603]
R13  Res3  value 100K  [J1-0603]
R14  Res3  value 100K  [J1-0603]
R15  Res3  value 100K  [J1-0603]
R16  Res3  value 300K  [J1-0603]
R17  Res3  value 1K  [J1-0603]
R18  Res3  value 1K  [J1-0603]
R19  Res3  value 100K  [J1-0603]
R20  Res3  value 100K  [J1-0603]
R21  Res3  value 100K  [J1-0603]
R23  Res3  value 1K  [J1-0603]
R24  Res3  value 1K  [J1-0603]
R25  Res3  value 100K  [J1-0603]
RP11  10k  [Trim_Bourns3296]
RP12  10k  [Trim_Bourns3296]
RP21  10k  [Trim_Bourns3296]
RP22  10k  [Trim_Bourns3296]
RP31  10k  [Trim_Bourns3296]
RP32  10k  [Trim_Bourns3296]
RP41  10k  [Trim_Bourns3296]
RP42  10k  [Trim_Bourns3296]
XF1  Res3  value 0  [J1-0603]
XF2  Res3  value 0  [J1-0603]
XF3  Res3  value 0  [J1-0603]
XF4  Res3  value 0  [J1-0603]

### Ports
AFH1 (out), AFH2 (out), AFH3 (out), AFH4 (out), EXT_AMP1_H1_IN (out), EXT_AMP1_H1_OUT (in), EXT_AMP2_H2_IN (out), EXT_AMP2_H2_OUT (in), EXT_AMP3_H3_IN (out), EXT_AMP3_H3_OUT (in), EXT_AMP4_H4_IN (out), EXT_AMP4_H4_OUT (in)

### Nets
5V: OP1.8(+V) OP2.8(+V) OP3.8(+V) OP4.8(+V) R1.2 R2.2 R6.2 R8.2 R10.2 R14.2 R16.2 R20.2
AGND: C10.1 C11.1 C13.1 C14.1 C16.1 C17.1 C19.1 C20.1 HP1.2(Y) HP2.2(Y) HP3.2(Y) HP4.2(Y) OP1.4(-V) OP2.4(-V) OP3.4(-V) OP4.4(-V) R3.1 R7.1 R9.1 R13.1 R15.1 R19.1 R21.1 R25.1
AINAP1: IF1.1 XF1.2 ; port AFH1
AINBP1: IF2.1 XF2.2 ; port AFH2
AINCP1: IF3.1 XF3.2 ; port AFH3
AINDP1: IF4.1 XF4.2 ; port AFH4
EXT_AMP1_H1_IN: HP1O.2 ; port EXT_AMP1_H1_IN
EXT_AMP1_H1_OUT: XF1.1 ; port EXT_AMP1_H1_OUT
EXT_AMP2_H2_IN: HP2O.2 ; port EXT_AMP2_H2_IN
EXT_AMP2_H2_OUT: XF2.1 ; port EXT_AMP2_H2_OUT
EXT_AMP3_H3_IN: HP3O.2 ; port EXT_AMP3_H3_IN
EXT_AMP3_H3_OUT: XF3.1 ; port EXT_AMP3_H3_OUT
EXT_AMP4_H4_IN: HP4O.2 ; port EXT_AMP4_H4_IN
EXT_AMP4_H4_OUT: XF4.1 ; port EXT_AMP4_H4_OUT
NetC2_1: C2.1 OP1.7(OUT_B) RP12.1
NetC2_2: C2.2 IF1.2 R2.1 R3.2
NetC3_1: C3.1 OP2.7(OUT_B) RP22.1
NetC3_2: C3.2 IF2.2 R6.1 R9.2
NetC9_1: C9.1 HP1I.1
NetC9_2: C9.2 OP1.3(+IN_A) R1.1 R7.2
NetC10_2: C10.2 R4.1
NetC11_2: C11.2 R5.1
NetC12_1: C12.1 HP2I.1
NetC12_2: C12.2 OP2.3(+IN_A) R8.1 R13.2
NetC13_2: C13.2 R11.1
NetC14_2: C14.2 R12.1
NetC15_1: C15.1 HP3I.1
NetC15_2: C15.2 OP3.3(+IN_A) R14.1 R19.2
NetC16_2: C16.2 R17.1
NetC17_2: C17.2 R18.1
NetC18_1: C18.1 HP4I.1
NetC18_2: C18.2 OP4.3(+IN_A) R20.1 R25.2
NetC19_2: C19.2 R23.1
NetC20_2: C20.2 R24.1
NetC24_1: C24.1 OP3.7(OUT_B) RP32.1
NetC24_2: C24.2 IF3.2 R10.1 R15.2
NetC25_1: C25.1 OP4.7(OUT_B) RP42.1
NetC25_2: C25.2 IF4.2 R16.1 R21.2
NetHP1_1: HP1.1(X) HP1I.2 HP1O.1
NetHP2_1: HP2.1(X) HP2I.2 HP2O.1
NetHP3_1: HP3.1(X) HP3I.2 HP3O.1
NetHP4_1: HP4.1(X) HP4I.2 HP4O.1
NetOP1_1: OP1.1(OUT_A) OP1.5(+IN_B) RP11.1
NetOP1_2: OP1.2(-IN_A) R4.2 RP11.2
NetOP1_6: OP1.6(-IN_B) R5.2 RP12.2
NetOP2_1: OP2.1(OUT_A) OP2.5(+IN_B) RP21.1
NetOP2_2: OP2.2(-IN_A) R11.2 RP21.2
NetOP2_6: OP2.6(-IN_B) R12.2 RP22.2
NetOP3_1: OP3.1(OUT_A) OP3.5(+IN_B) RP31.1
NetOP3_2: OP3.2(-IN_A) R17.2 RP31.2
NetOP3_6: OP3.6(-IN_B) R18.2 RP32.2
NetOP4_1: OP4.1(OUT_A) OP4.5(+IN_B) RP41.1
NetOP4_2: OP4.2(-IN_A) R23.2 RP41.2
NetOP4_6: OP4.6(-IN_B) R24.2 RP42.2

Not connected (* = marked no-connect by the designer): RP11 3*; RP12 3; RP21 3*; RP22 3*; RP31 3*; RP32 3*; RP41 3*; RP42 3*

### Library data of the parts
C2 C3 C9-C20 C24 C25 = Cap Semi: Capacitor (Semiconductor SIM Model); Published: 8-Jun-2000; LatestRevisionDate: 29-May-2009; LatestRevisionNote: IPC-7351 Footprint Added.; PackageReference: C1206; Publisher: Altium Limited; PackageDescription: Chip Capacitor
HP1-HP4 = BNC: BNC Elbow Connector; LatestRevisionDate: 17-Jul-2002; LatestRevisionNote: Re-released for DXP Platform.; Publisher: Altium Limited
HP1I HP1O HP2I HP2O HP3I HP3O HP4I HP4O IF1-IF4 R1-R21 R23-R25 XF1-XF4 = Res3: Resistor; Published: 8-Jun-2000; LatestRevisionDate: 29-May-2009; LatestRevisionNote: IPC-7351 Footprint Added.; PackageReference: J1-0603; Publisher: Altium Limited; PackageDescription: Chip Resistor
OP1-OP4 = OP262TRZ-EP: as OP5 on sheet HydrophoneGroup2FilterAndAmpCircuit; DatasheetVersion: Rev. G; PackageVersion: 060506-A; PackageReference: R-8; PackageDescription: 8-Pin Standard Small Outline Package, Body 3.9 x 4.9 mm, Pitch 1.27 mm; Supplier 1: Digi-Key; Supplier Part Number 1: OP262TRZ-EP-ND; Supplier 2: Newark; Supplier Part Number 2: 85R9009; Packing: Tube; Mounting Technology: Surface Mount; Code_JEDEC: MS-012-AA; PartNumber: OP262TRZ-EP; ComponentLink1Description: Manufacturer URL; ComponentLink1URL: http://www.analog.com/en/index.html; ComponentLink2Description: Datasheet; ComponentLink2URL: http://www.analog.com/static/imported-files/data_sheets/OP162_262_462.pdf; ComponentLink3Description: Package Specification; ComponentLink3URL: http://www.analog.com/static/imported-files/packages/PKG_PDF/SOIC_Narrow%20(R)/R_8.pdf
RP11 RP12 RP21 RP22 RP31 RP32 RP41 RP42 = RES_Trim: as RP51 on sheet HydrophoneGroup2FilterAndAmpCircuit; Value: 10k; Type: RES; Distributor info: RS 3296Y-1-xxxLF (1k=3296Y-1-102LF); Price: 2,03; ComponentLink1Description: Manufacturer; ComponentLink1URL: http://bourns.de/; Creation Date: 05.12.2011; IPC: False

## Nets that join several sheets
5V: HANC_Analog_TS (AVD.1 DVD.1 PC1.1), HydrophoneGroup2FilterAndAmpCircuit (OP5.8 R22.2 R26.2), HydrophoneGroup1FilterAndAmpCircuit (12 pins)
A3V3: HANC_Analog_TS (C4.2 LMA1.3 TEST.2), MAXIM-ADC1 (IAV1.2)
AGND: HANC_Analog_TS (11 pins), MAXIM-ADC2 (19 pins), HydrophoneGroup2FilterAndAmpCircuit (6 pins), MAXIM-ADC1 (25 pins), HydrophoneGroup1FilterAndAmpCircuit (24 pins)
AVDD: MAXIM-ADC2 (7 pins), MAXIM-ADC1 (10 pins)
D3V3: HANC_Analog_TS (C7.2 LMD1.3 TEST.1), MAXIM-ADC1 (IDV1.2)
DGND: HANC_Analog_TS (6 pins), MAXIM-ADC2 (9 pins), MAXIM-ADC1 (9 pins)
DVDD: MAXIM-ADC2 (5 pins), MAXIM-ADC1 (6 pins)
AINAP1: MAXIM-ADC1 (C105.1 PTST1.1), HydrophoneGroup1FilterAndAmpCircuit (IF1.1 XF1.2)
AINAP2: MAXIM-ADC2 (C205.1 PTST2.1), HydrophoneGroup2FilterAndAmpCircuit (IF5.1 XF5.2)
AINBP1: MAXIM-ADC1 (C111.1 PTST1.2), HydrophoneGroup1FilterAndAmpCircuit (IF2.1 XF2.2)
AINCP1: MAXIM-ADC1 (C119.1 PTST1.3), HydrophoneGroup1FilterAndAmpCircuit (IF3.1 XF3.2)
AINDP1: MAXIM-ADC1 (C129.1 PTST1.4), HydrophoneGroup1FilterAndAmpCircuit (IF4.1 XF4.2)
EXT_AMP1_H1_IN: MAXIM-ADC1 (PHOUT.1), HydrophoneGroup1FilterAndAmpCircuit (HP1O.2)
EXT_AMP1_H1_OUT: MAXIM-ADC1 (EFIN.1), HydrophoneGroup1FilterAndAmpCircuit (XF1.1)
EXT_AMP2_H2_IN: MAXIM-ADC1 (PHOUT.2), HydrophoneGroup1FilterAndAmpCircuit (HP2O.2)
EXT_AMP2_H2_OUT: MAXIM-ADC1 (EFIN.2), HydrophoneGroup1FilterAndAmpCircuit (XF2.1)
EXT_AMP3_H3_IN: MAXIM-ADC1 (PHOUT.3), HydrophoneGroup1FilterAndAmpCircuit (HP3O.2)
EXT_AMP3_H3_OUT: MAXIM-ADC1 (EFIN.3), HydrophoneGroup1FilterAndAmpCircuit (XF3.1)
EXT_AMP4_H4_IN: MAXIM-ADC1 (PHOUT.4), HydrophoneGroup1FilterAndAmpCircuit (HP4O.2)
EXT_AMP4_H4_OUT: MAXIM-ADC1 (EFIN.4), HydrophoneGroup1FilterAndAmpCircuit (XF4.1)
M1-PA5_SCLK: HANC_Analog_TS (PM1.7), MAXIM-ADC1 (U101.16)
M1-PA6_MISO: HANC_Analog_TS (PM1.5), MAXIM-ADC1 (U101.14)
M1-PA7_MOSI: HANC_Analog_TS (PM1.6), MAXIM-ADC1 (U101.15)
M1_EXT_AV: HANC_Analog_TS (P7.1), MAXIM-ADC1 (EAV1.2)
M1_EXT_DV: HANC_Analog_TS (P7.2), MAXIM-ADC1 (EDV1.2)
M2-PA5_SCLK: HANC_Analog_TS (PM2.7), MAXIM-ADC2 (U201.16)
M2-PA6_MISO: HANC_Analog_TS (PM2.5), MAXIM-ADC2 (U201.14)
M2-PA7_MOSI: HANC_Analog_TS (PM2.6), MAXIM-ADC2 (U201.15)
MAX1_OSCOUT: HANC_Analog_TS (C1.2), MAXIM-ADC1 (C131.1 U101.20)
MAX2_OSCOUT: HANC_Analog_TS (C6.2), MAXIM-ADC2 (C231.1 U201.20)
NetC203_1: MAXIM-ADC2 (C203.1 S5.2), MAXIM-ADC1 (D5.2)
NetEFIN_5: HydrophoneGroup2FilterAndAmpCircuit (XF5.1), MAXIM-ADC1 (EFIN.5)
NetHP5O_2: HydrophoneGroup2FilterAndAmpCircuit (HP5O.2), MAXIM-ADC1 (PHOUT.5)
PA8_MCO1: HANC_Analog_TS (PM1.1), MAXIM-ADC1 (C130.1 U101.19)
PB0_SHDN1: HANC_Analog_TS (PM1.10), MAXIM-ADC1 (U101.21)
PB1_UP-DWN1: HANC_Analog_TS (PM1.2), MAXIM-ADC1 (U101.10)
PB2_DACSTEP1: HANC_Analog_TS (PM1.3), MAXIM-ADC1 (U101.11)
PB10_CONVRUN1: HANC_Analog_TS (PM1.9), MAXIM-ADC1 (U101.12)
PB12_EOC2: HANC_Analog_TS (PM2.8), MAXIM-ADC2 (U201.18)
PB13_EOC1: HANC_Analog_TS (PM1.8), MAXIM-ADC1 (U101.18)
PC9_MCO2: HANC_Analog_TS (PM2.1), MAXIM-ADC2 (C230.1 U201.19)
PD0_CS1: HANC_Analog_TS (PM1.4), MAXIM-ADC1 (U101.13)
PD1_CS2: HANC_Analog_TS (PM2.4), MAXIM-ADC2 (U201.13)
PD10_SHDN2: HANC_Analog_TS (PM2.10), MAXIM-ADC2 (U201.21)
PD11_UP-DWN2: HANC_Analog_TS (PM2.2), MAXIM-ADC2 (U201.10)
PD12_DACSTEP2: HANC_Analog_TS (PM2.3), MAXIM-ADC2 (U201.11)
PE15_CONVRUN2: HANC_Analog_TS (PM2.9), MAXIM-ADC2 (U201.12)